# EasyEDA Pro project ProPrj_智能车主控V5.0-20251108_2026-08-26.epro, board PCB1_2
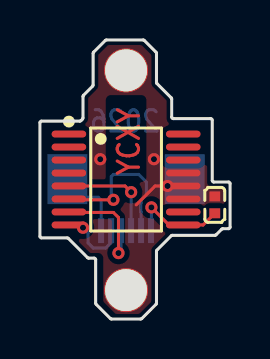
[diagram p11: board, top side]
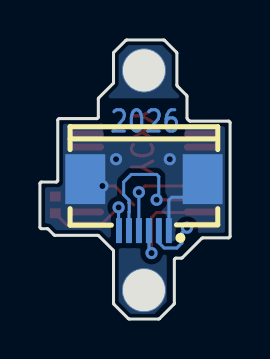
[diagram p12: board, bottom side, seen from below]

Outline 9.53 x 13.97 mm; copper layers: Top Layer, Bottom Layer. Coordinates in mm from the lower left corner of the outline.
Outline path: 0,9.83 arc(0.02,9.88) 0.08,9.91 2,9.91 arc(2.03,9.91) 2.05,9.93 2.14,10.01 arc(2.15,10.04) 2.16,10.06 2.16,11.14 arc(2.16,11.17) 2.18,11.2 2.64,11.66 arc(2.66,11.69) 2.67,11.72 2.67,13.3 arc(2.67,13.33) 2.69,13.36 3.28,13.95 arc(3.3,13.96) 3.33,13.97 5.18,13.97 arc(5.2,13.96) 5.23,13.95 5.82,13.36 arc(5.84,13.33) 5.84,13.3 5.84,11.84 arc(5.85,11.81) 5.86,11.79 6.58,11.07 arc(6.6,11.05) 6.6,11.02 6.6,10.11 arc(6.63,10.06) 6.68,10.03 8.56,10.03 arc(8.61,10.01) 8.64,9.96 8.64,6.93 arc(8.66,6.88) 8.71,6.86 9.45,6.86 arc(9.51,6.84) 9.53,6.78 9.53,4.6 arc(9.51,4.54) 9.45,4.52 9.17,4.52 arc(9.14,4.52) 9.11,4.5 8.83,4.21 arc(8.8,4.2) 8.77,4.19 6.64,4.19 arc(6.61,4.19) 6.58,4.17 5.86,3.45 arc(5.85,3.43) 5.84,3.4 5.84,0.79 arc(5.84,0.76) 5.82,0.74 5.1,0.02 arc(5.08,0.01) 5.05,0 3.59,0 arc(3.56,0.01) 3.53,0.02 2.82,0.74 arc(2.8,0.76) 2.79,0.79 2.79,2.97 arc(2.77,3.03) 2.72,3.05 2.44,3.05 arc(2.42,3.05) 2.39,3.07 1.42,4.04 arc(1.39,4.06) 1.37,4.06 0.08,4.06 arc(0.02,4.09) 0,4.14 0,9.83
Stack: Top Layer 0.035mm / Dielectric1 1.51mm FR4 er 4.5 / Bottom Layer 0.035mm

## Design rules (mm)
spacing copperThickness1oz (default): track to track 0.102, other pairs 0.152 to 0.3
spacing copperThickness2oz: track to track 0.203, other pairs 0.152 to 0.3
track width copperThickness1oz (default): min 0.127, default 0.254, max 2.54
track width copperThickness2oz: min 0.203, default 0.254, max 2.54
differential pair differentialPair (default): width min 0.127, default 0.254, max 2.54; gap min 0.152, default 0.152
net GND uses copperRegion

## Placement (name value [footprint] x y rotation side)
C3  100nF  [C0402]  8.76 5.72 270 top
FPC1  FPC-05F-6PH20  [FPC-SMD_6P-P0.50_XUNPU_FPC-05F-6PH20]  4.32 5.72 0 bottom
NOREF  -  [Pad_e5]  4.32 12.45 0 top
NOREF#2  -  [Pad_e6]  4.32 1.45 0 top
U2  MT6835GT-STD-R  [TSSOP-16_L5.0-W4.4-P0.65-LS6.4-BL]  4.32 6.98 270 top

## Footprints (pads in the part's own frame, mm; a bottom-side part is the same pattern mirrored in y, then rotated)
C0402
  rect 0.5x0.54 smd: 1(-0.42,0) 2(0.42,0)
FPC-SMD_6P-P0.50_XUNPU_FPC-05F-6PH20
  rect 0.3x1.25 smd: 1(-1.25,1.288) 2(-0.75,1.288) 3(-0.25,1.288) 4(0.25,1.288) 5(0.75,1.288) 6(1.25,1.288)
  rect 2x2.5 smd: 7(2.94,-1.288) 8(-2.94,-1.288)
Pad_e5
  round 2.2 hole 2.1: 1(0,0)
Pad_e6
  round 2.2 hole 2.1: 1(0,0)
TSSOP-16_L5.0-W4.4-P0.65-LS6.4-BL
  oval 0.343x1.732 smd: 1(-2.275,-2.866) 2(-1.625,-2.866) 3(-0.975,-2.866) 4(-0.325,-2.866) 5(0.325,-2.866) 6(0.975,-2.866) 7(1.625,-2.866) 8(2.275,-2.866) 9(2.275,2.866) 10(1.625,2.866) 11(0.975,2.866) 12(0.325,2.866) 13(-0.325,2.866) 14(-0.975,2.866) 15(-1.625,2.866) 16(-2.275,2.866)

## Nets
As in the schematic, except:
GND: C3.1 FPC1.1 FPC1.7 FPC1.8 NOREF.1 NOREF#2.1 U2.11 U2.12 U2.13

Pads without a net: U2 1 2 3 4 10 14 15 16

## Via types
v1: diameter 0.61, hole 0.305, Top Layer to Bottom Layer, 8 vias

## Routing (per net, layer and track width the routed paths; a pad name or vN(x,y) marks a point on that pad's centre or on a via; arc(x,y) is an arc through that point)
GND: length 5.6
  Top Layer w0.152: 4.83,5.72 5.77,6.66 v1(6.4,6.66)
  Bottom Layer w0.152: FPC1.1 3.07,5.95 2.92,6.1 2.28,6.1 FPC1.8
  vias: v1(3.02,8) v1(5.72,8)
VCC: length 4.9
  Top Layer w0.152: v1(5.59,5.59) 6.47,4.71 U2.9 8.18,4.71 C3.2
  Bottom Layer w0.152: FPC1.6 5.59,4.45 v1(5.59,5.59)
CLK: length 5.6
  Top Layer w0.152: v1(3.94,3.3) 3.94,5.08 3.68,5.33 1.48,5.33 U2.7
  Bottom Layer w0.152: v1(3.94,3.3) 4.07,3.43 FPC1.3
CS: length 2.8
  Bottom Layer w0.152: FPC1.2 3.57,3.82 3.3,3.56 2.67,3.56 2.41,3.81 2.41,4.32 v1(2.16,4.57)
MISO: length 5.2
  Top Layer w0.152: v1(4.57,6.35) 4.26,6.66 U2.5
  Bottom Layer w0.152: FPC1.4 4.57,4.43 v1(4.57,6.35)
MOSI: length 8
  Top Layer w0.152: U2.6 1.49,5.97 v1(3.68,5.97)
  Bottom Layer w0.152: FPC1.5 5.07,5.35 5.06,5.37 5.06,5.81 5.07,5.82 5.07,5.96 5.33,6.22 5.33,6.86 4.95,7.24 3.68,7.24 3.58,7.13 3.58,6.08 v1(3.68,5.97)

## Copper pours and planes (outline as drawn; the poured copper is in the pictures)
GND on Top Layer: -0.76,14.48 9.91,14.48 9.91,-0.38 -0.76,-0.38
GND on Bottom Layer: -0.76,14.48 10.41,14.48 10.41,-1.27 -0.76,-1.27

## Text on the board
Bottom Layer: 2026
Top Layer: YCXY
